# Altium schematic sheet 11.SchDoc
size 513 x 386 mm
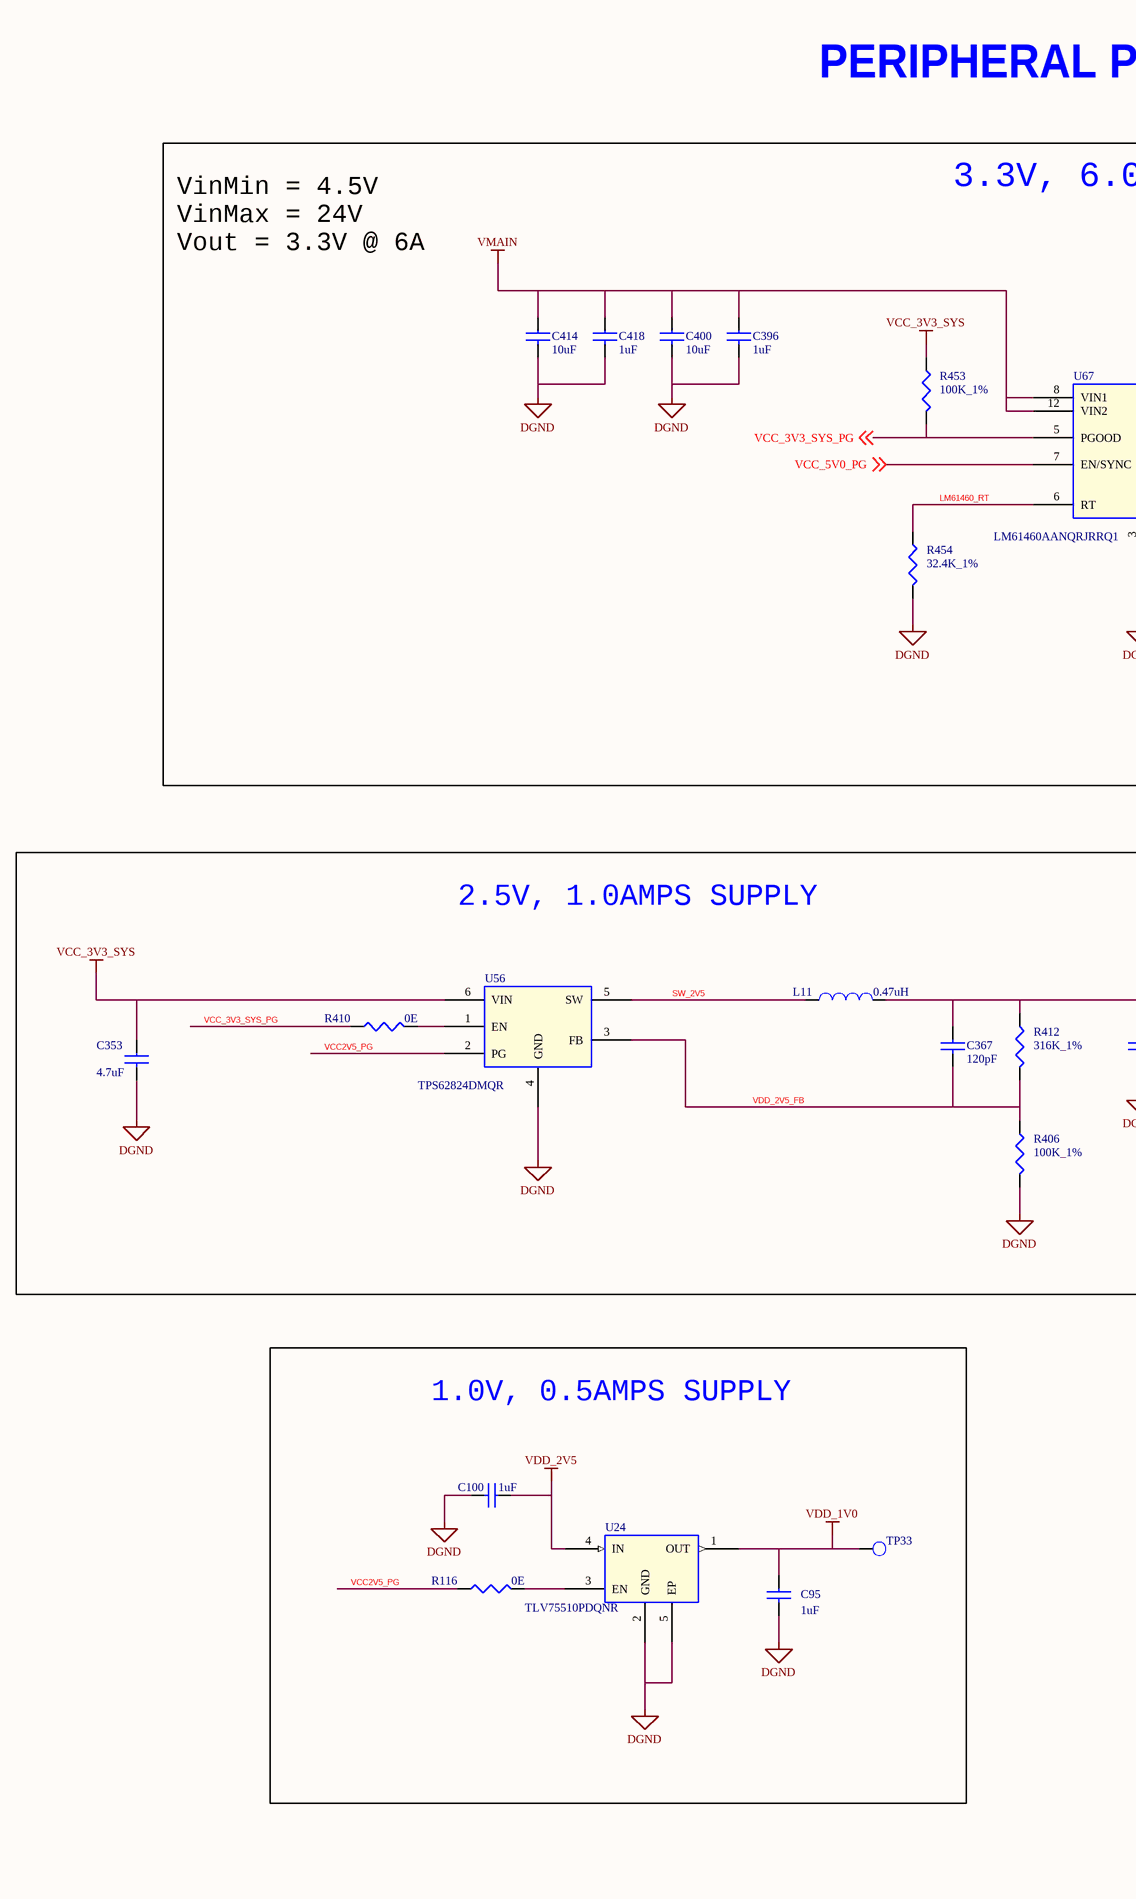
[diagram p0: 11.SchDoc, left]
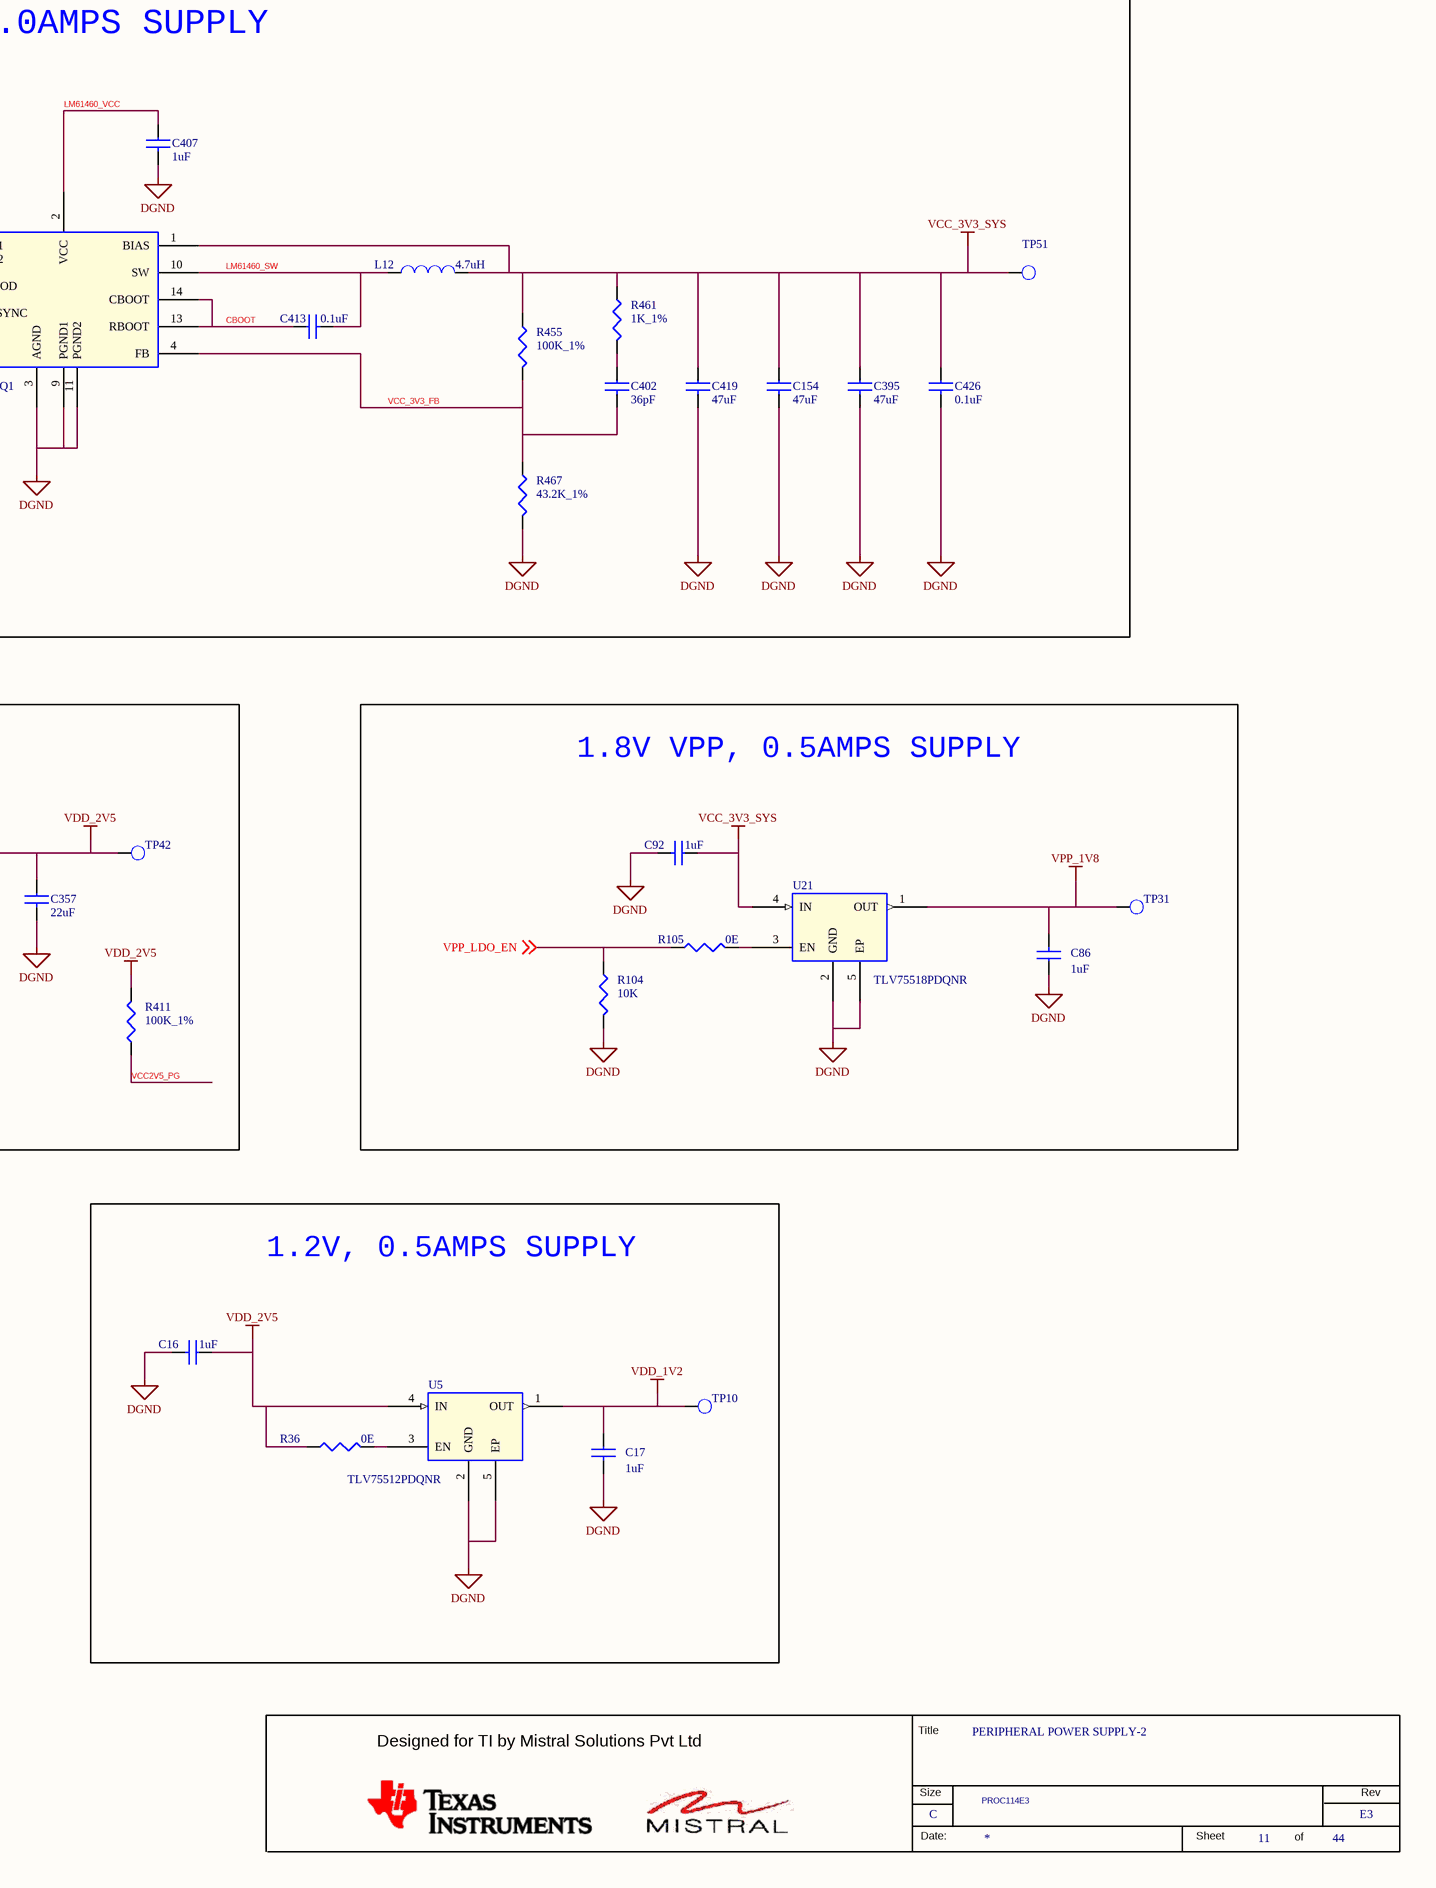
[diagram p1: 11.SchDoc, right]

## Parts
*  RevCode: E3  Title: PERIPHERAL POWER SUPPLY-2  Page Size: C  Page Number: 11  Page Count: 44  Variant Name: PROC114E3  (hidden comment: MISTRAL_TITLEBLK_CSIZE)  (graphical)
C16  1uF  [CAP0201_0-5]
C17  1uF  [CAP0201_0-5]
C86  1uF  [CAP0201_0-5]
C92  1uF  [CAP0201_0-5]
C95  1uF  [CAP0201_0-5]
C100  1uF  [CAP0201_0-5]
C154  47uF  [CAP1210_2-75]
C353  4.7uF  [CAP0603_1]
C357  22uF  [CAP0603_1]
C367  120pF  [CAP0201_0-5]
C395  47uF  [CAP1210_2-75]
C396  1uF  [CAP0805_1-5]
C400  10uF  [CAP0603_1]
C402  36pF  [CAP0402_0-75]
C407  1uF  [CAP0201_0-5]
C413  0.1uF  [CAP0402_0-75]
C414  10uF  [CAP0603_1]
C418  1uF  [CAP0805_1-5]
C419  47uF  [CAP1210_2-75]
C426  0.1uF  [CAP0402_0-75]
L11  0.47uH  [IND0806_1-2]
L12  4.7uH  [IND_XAL6060_260X270_SMD_6-1]
R36  0E  [RES0201_0-5]
R104  10K  [RES0201_0-5]
R105  0E  [RES0201_0-5]
R116  0E  [RES0201_0-5]
R406  100K_1%  [RES0402_0-5]
R410  0E  [RES0201_0-5]
R411  100K_1%  [RES0402_0-5]
R412  316K_1%  [RES0402_0-5]
R453  100K_1%  [RES0402_0-5]
R454  32.4K_1%  [RES0402_0-5]
R455  100K_1%  [RES0402_0-5]
R461  1K_1%  [RES0402_0-5]
R467  43.2K_1%  [RES0402_0-5]
TP10  TP20_SMD  [TP20_SMD]  (value not drawn)
TP31  TP20_SMD  [TP20_SMD]  (value not drawn)
TP33  TP20_SMD  [TP20_SMD]  (value not drawn)
TP42  TP20_SMD  [TP20_SMD]  (value not drawn)
TP51  TP20_SMD  [TP20_SMD]  (value not drawn)
U5  TLV75512PDQNR  [X2SON4_TLV71318P_40X40_0-4]
U21  TLV75518PDQNR  [X2SON4_TLV71318P_40X40_0-4]
U24  TLV75510PDQNR  [X2SON4_TLV71318P_40X40_0-4]
U56  TPS62824DMQR  [VSONHR6_TPS62826_60X60_1]
U67  LM61460AANQRJRRQ1  [VQFNHR14_LM61460_160X140_1]

## Blocks framed on the sheet
3.3V, 6.0AMPS SUPPLY: C154 C395 C396 C400 C402 C407 C413 C414 C418 C419 C426 L12 R453-R455 R461 R467 TP51 U67
2.5V, 1.0AMPS SUPPLY: C353 C357 C367 L11 R406 R410-R412 TP42 U56
1.8V VPP, 0.5AMPS SUPPLY: C86 C92 R104 R105 TP31 U21
1.0V, 0.5AMPS SUPPLY: C95 C100 R116 TP33 U24
1.2V, 0.5AMPS SUPPLY: C16 C17 R36 TP10 U5

## Nets
DGND: C16.2 C17.2 C86.1 C92.2 C95.2 C100.2 C154.2 C353.2 C357.2 C395.2 C396.2 C400.2 C407.2 C414.2 C418.2 C419.2 C426.2 R104.2 R406.2 R454.2 R467.2 U5.2(GND) U5.5(EP) U21.2(GND) U21.5(EP) U24.2(GND) U24.5(EP) U56.4(GND) U67.3(AGND) U67.9(PGND1) U67.11(PGND2)
VCC_3V3_SYS: C92.1 C154.1 C353.1 C395.1 C419.1 C426.1 L12.2 R453.1 R455.1 R461.1 TP51.1(TP) U21.4(IN) U56.6(VIN) U67.1(BIAS)
VDD_1V0: C95.1 TP33.1(TP) U24.1(OUT)
VDD_1V2: C17.1 TP10.1(TP) U5.1(OUT)
VDD_2V5: C16.1 C100.1 C357.1 C367.1 L11.2 R36.1 R411.2 R412.1 TP42.1(TP) U5.4(IN) U24.4(IN)
VMAIN: C396.1 C400.1 C414.1 C418.1 U67.8(VIN1) U67.12(VIN2)
VPP_1V8: C86.2 TP31.1(TP) U21.1(OUT)
CBOOT: C413.1 U67.13(RBOOT) U67.14(CBOOT)
LM61460_RT: R454.1 U67.6(RT)
LM61460_SW: C413.2 L12.1 U67.10(SW)
LM61460_VCC: C407.1 U67.2(VCC)
SW_2V5: L11.1 U56.5(SW)
VCC2V5_PG: R116.1 R411.1 U56.2(PG)
VCC_3V3_FB: C402.2 R455.2 R467.1 U67.4(FB)
VCC_3V3_SYS_PG: R410.1 R453.2 U67.5(PGOOD) ; off-sheet VCC_3V3_SYS_PG
VCC_5V0_PG: U67.7(EN/SYNC) ; off-sheet VCC_5V0_PG
VDD_2V5_FB: C367.2 R406.1 R412.2 U56.3(FB)
VPP_LDO_EN: R104.1 R105.1 ; off-sheet VPP_LDO_EN
NetC402_1: C402.1 R461.2
NetR36_2: R36.2 U5.3(EN)
NetR105_2: R105.2 U21.3(EN)
NetR116_2: R116.2 U24.3(EN)
NetR410_2: R410.2 U56.1(EN)

## Notes on the sheet
- PERIPHERAL POWER SUPPLY-2
- VinMin = 4.5V
  VinMax = 24V
  Vout = 3.3V @ 6A
- (in symbol MISTRAL_TITLEBLK_CSIZE) Title; Designed for TI by Mistral Solutions Pvt Ltd; Size; Rev; Date:; Sheet; of

## Library data of the parts
* = MISTRAL_TITLEBLK_CSIZE: Issue: 1.0; Page Create Date: March  8, 1995; Page Modify Date: *; Schematic Page Count: 44; Schematic Page Number: 11
C16 C407 = CAP_Dup2: CAP CERAMIC 1uF 16V 20% X5R 0201; Mistral Part No: 120018090038-R; Mfr_name: MURATA; Mfr_part_number: GRM033R61C105ME15D; Part_type: CAPACITORS\CERAMIC; Project: QCS610_NANOSOM; Wattage: NA; Customs_HS_Code: 85322990; Custom_Duty: 15%; Library Ref: CAP; MECHANICAL 3D STEP FILE: CAP0201_0-5; Tolerance: 20%; Voltage: 16V; Package: 0201; Distributor_name: DIGIKEY; Distributor_part_number: 490-18654-1-ND; Height: 0.39MM; Weight: 0.33mg; Temperature: -55°C+85°C; Datasheet: Y:\MIS_DATABASE\DATASHEETS\CAPACITORS\GRM033R61C105ME15.PDF; Crtd /date: ALVY/260520; Chkd/date: MANIRAJA/300520; Footprint Ref: CAP0201_0-5; Library Path: Y:\MIS_DATABASE\Library\ALTIUM_TOOL\SCHEMATICS_PARTS\MS_DISCRETE_Library.schlib; Footprint Path: Y:\MIS_DATABASE\Library\ALTIUM_TOOL\PCB_FOOTPRINTS\Altium_Footprint_Lib.PcbLib; PCB Footprint: CAP0201_0-5
C17 C86 C92 C95 C100 = CAP_Dup2: CAP CERAMIC 1uF 16V 20% X5R 0201; Part_type: CAPACITORS\CERAMIC; Mfr_part_number: GRM033R61C105ME15D; Mfr_name: MURATA; Mistral Part No: 120018090038-R; Custom_Duty: 15%; Customs_HS_Code: 85322990; Wattage: NA; Project: QCS610_NANOSOM; Footprint Path: Y:\MIS_DATABASE\Library\ALTIUM_TOOL\PCB_FOOTPRINTS\Altium_Footprint_Lib.PcbLib; Library Path: Y:\MIS_DATABASE\Library\ALTIUM_TOOL\SCHEMATICS_PARTS\MS_DISCRETE_Library.schlib; Footprint Ref: CAP0201_0-5; Chkd/date: MANIRAJA/300520; Crtd /date: ALVY/260520; Datasheet: Y:\MIS_DATABASE\DATASHEETS\CAPACITORS\GRM033R61C105ME15.PDF; Temperature: -55°C+85°C; Weight: 0.33mg; Height: 0.39MM; Distributor_part_number: 490-18654-1-ND; Distributor_name: DIGIKEY; Package: 0201; Voltage: 16V; Tolerance: 20%; MECHANICAL 3D STEP FILE: CAP0201_0-5; Library Ref: CAP; PCB Footprint: CAP0201_0-5
C154 C419 = CAP_Dup2: CAP CERAMIC 47uF 16V 10% X6S 1210; Mistral Part No: 120021070001-R; Mfr_name: MURATA; Mfr_part_number: GRM32EC81C476KE15L; Part_type: CAPACITORS\CERAMIC; Project: TI_AM263X_CC; Wattage: NA; Customs_HS_Code: 85322990; Custom_Duty: 15%; Footprint Ref: CAP1210_2-75; Tolerance: 10%; Voltage: 16V; Package: 1210; Distributor_name: DIGIKEY; Distributor_part_number: 490-10531-1-ND; Library Ref: CAP; Height: 2.70MM; Weight: 100mg; Temperature: -55°C+105°C; Datasheet: Y:\MIS_DATABASE\DATASHEETS\CAPACITORS\GRM32EC81C476KE15.PDF; Crtd /date: MANIRAJA/010721; Chkd/date: ALVY/010721; MECHANICAL 3D STEP FILE: CAP1210_2-75; Library Path: Y:\MIS_DATABASE\Library\ALTIUM_TOOL\SCHEMATICS_PARTS\MS_DISCRETE_Library.schlib; Footprint Path: Y:\MIS_DATABASE\Library\ALTIUM_TOOL\PCB_FOOTPRINTS\Altium_Footprint_Lib.PcbLib; PCB Footprint: CAP1210_2-75
C353 = CAP_Dup2: CAP CERAMIC 4.7uF 35V 20% X5R 0603; Mistral Part No: 120020050017-R; Mfr_name: MURATA; Mfr_part_number: GRM188R6YA475ME15D; Part_type: CAPACITORS\CERAMIC; Project: SD865_NANOSOM; Wattage: NA; Customs_HS_Code: 85322990; Custom_Duty: 15%; PCB Footprint: CAP0603_1; Footprint Path: Y:\MIS_DATABASE\Library\ALTIUM_TOOL\PCB_FOOTPRINTS\Altium_Footprint_Lib.PcbLib; Library Path: Y:\MIS_DATABASE\Library\ALTIUM_TOOL\SCHEMATICS_PARTS\MS_DISCRETE_Library.schlib; Footprint Ref: CAP0603_1; Library Ref: CAP; Tolerance: 20%; Voltage: 35V; Package: 0603; Distributor_name: DIGIKEY; Distributor_part_number: 490-11995-1-ND; Height: 1.00MM; Weight: 6.3mg; Temperature: -55°C+85°C; Datasheet: Y:\MIS_DATABASE\DATASHEETS\CAPACITORS\GRM188R6YA475ME15.PDF; Crtd /date: ALVY/120520; Chkd/date: MANIRAJA/120520; MECHANICAL 3D STEP FILE: CAP0603_1
C357 = CAP_Dup2: CAP CERAMIC 22uF 10V 20% X5R 0603; Mistral Part No: 120014100009-R; Mfr_name: MURATA; Mfr_part_number: GRM188R61A226ME15D; Part_type: CAPACITORS\CERAMIC; Project: TI_MAXIE_CPB; Wattage: NA; Customs_HS_Code: 85322990; Custom_Duty: 15%; PCB Footprint: CAP0603_1; Footprint Path: Y:\MIS_DATABASE\Library\ALTIUM_TOOL\PCB_FOOTPRINTS\Altium_Footprint_Lib.PcbLib; Library Path: Y:\MIS_DATABASE\Library\ALTIUM_TOOL\SCHEMATICS_PARTS\MS_DISCRETE_Library.schlib; MECHANICAL 3D STEP FILE: CAP0603_1; Footprint Ref: CAP0603_1; Library Ref: CAP; Tolerance: 20%; Voltage: 10V; Package: 0603; Distributor_name: DIGIKEY; Distributor_part_number: 490-10476-1-ND; Height: 1.00MM; Weight: 6.3mg; Temperature: -55°C+85°C; Datasheet: Y:\MIS_DATABASE\DATASHEETS\CAPACITORS\GRM188R61A226ME15.PDF; Crtd /date: MANIRAJA/230118; Chkd/date: MANIRAJA/230118
C367 = CAP_Dup2: CAP CERAMIC 120pF 25V 10% X7R 0201; Part_type: CAPACITORS\CERAMIC; Mfr_part_number: GRM033R71E121KA01D; Mfr_name: MURATA; Mistral Part No: 120021080009-R; Custom_Duty: 15%; Customs_HS_Code: 85322990; Wattage: NA; Project: TI_AM62x SKEVM_BRD; PCB Footprint: CAP0201_0-5; Footprint Path: Y:\MIS_DATABASE\Library\ALTIUM_TOOL\PCB_FOOTPRINTS\Altium_Footprint_Lib.PcbLib; Library Path: Y:\MIS_DATABASE\Library\ALTIUM_TOOL\SCHEMATICS_PARTS\MS_DISCRETE_Library.schlib; MECHANICAL 3D STEP FILE: CAP0201_0-5; Chkd/date: ALVY/260821; Crtd /date: MANIRAJA/260821; Datasheet: Y:\MIS_DATABASE\DATASHEETS\CAPACITORS\GRM033R71E121KA01.PDF; Temperature: -55°C+125°C; Weight: 0.33mg; Height: 0.33MM; Library Ref: CAP; Distributor_part_number: 490-3173-1-ND; Distributor_name: DIGIKEY; Package: 0201; Voltage: 25V; Tolerance: 10%; Footprint Ref: CAP0201_0-5
C395 = CAP_Dup2: CAP CERAMIC 47uF 16V 10% X6S 1210; Part_type: CAPACITORS\CERAMIC; Mfr_part_number: GRM32EC81C476KE15L; Mfr_name: MURATA; Mistral Part No: 120021070001-R; Custom_Duty: 15%; Customs_HS_Code: 85322990; Wattage: NA; Project: TI_AM263X_CC; Footprint Path: Y:\MIS_DATABASE\Library\ALTIUM_TOOL\PCB_FOOTPRINTS\Altium_Footprint_Lib.PcbLib; Library Path: Y:\MIS_DATABASE\Library\ALTIUM_TOOL\SCHEMATICS_PARTS\MS_DISCRETE_Library.schlib; MECHANICAL 3D STEP FILE: CAP1210_2-75; Chkd/date: ALVY/010721; Crtd /date: MANIRAJA/010721; Datasheet: Y:\MIS_DATABASE\DATASHEETS\CAPACITORS\GRM32EC81C476KE15.PDF; Temperature: -55°C+105°C; Weight: 100mg; Height: 2.70MM; Library Ref: CAP; Distributor_part_number: 490-10531-1-ND; Distributor_name: DIGIKEY; Package: 1210; Voltage: 16V; Tolerance: 10%; Footprint Ref: CAP1210_2-75; PCB Footprint: CAP1210_2-75
C396 C418 = CAP_Dup2: CAP CERAMIC 1uF 100V 10% X7S 0805; Mistral Part No: 120013030002-R; Mfr_name: MURATA; Mfr_part_number: GRM21BC72A105KE01L; Part_type: CAPACITORS\CERAMIC; Project: TI_AM62x SKEVM_BRD; Wattage: NA; Customs_HS_Code: 85322990; Custom_Duty: 15%; Footprint Ref: CAP0805_1-5; Tolerance: 10%; Voltage: 100V; Package: 0805; Distributor_name: DIGIKEY; Distributor_part_number: 490-14464-1-ND; Library Ref: CAP; Height: 1.45MM; Weight: 6.4mg; Temperature: -55°C+125°C; Datasheet: Y:\MIS_DATABASE\DATASHEETS\CAPACITORS\GRM21BC72A105KE01.PDF; Crtd /date: ALVY/150921; Chkd/date: MANIRAJA/160921; MECHANICAL 3D STEP FILE: CAP0805_1-5; Library Path: Y:\MIS_DATABASE\Library\ALTIUM_TOOL\SCHEMATICS_PARTS\MS_DISCRETE_Library.schlib; Footprint Path: Y:\MIS_DATABASE\Library\ALTIUM_TOOL\PCB_FOOTPRINTS\Altium_Footprint_Lib.PcbLib; PCB Footprint: CAP0805_1-5
C400 = CAP_Dup2: CAP CERAMIC 10uF 35V 20% X5R 0603; Mistral Part No: 120019050016-R; Mfr_name: MURATA; Mfr_part_number: GRM188R6YA106MA73D; Part_type: CAPACITORS\CERAMIC; Project: BRUKER_SD820_COMMONDO; Wattage: NA; Customs_HS_Code: 85322990; Custom_Duty: 15%; Footprint Ref: CAP0603_1; Tolerance: 20%; Voltage: 35V; Package: 0603; Distributor_name: DIGIKEY; Distributor_part_number: 490-13248-1-ND; Library Ref: CAP; Height: 1.00MM; Weight: 9mg; Temperature: -55°C+85°C; Datasheet: Y:\MIS_DATABASE\DATASHEETS\CAPACITORS\GRM188R6YA106MA73.PDF; Crtd /date: ALVY/160519; Chkd/date: MANIRAJA/170519; MECHANICAL 3D STEP FILE: CAP0603_1; Library Path: Y:\MIS_DATABASE\Library\ALTIUM_TOOL\SCHEMATICS_PARTS\MS_DISCRETE_Library.schlib; Footprint Path: Y:\MIS_DATABASE\Library\ALTIUM_TOOL\PCB_FOOTPRINTS\Altium_Footprint_Lib.PcbLib; PCB Footprint: CAP0603_1
C402 = CAP_Dup2: CAP CERAMIC 36pF 50V 2% HI-Q C0G(NP0) 0402; Mistral Part No: 120021100002-R; Mfr_name: MURATA; Mfr_part_number: GJM1555C1H360GB01D; Part_type: CAPACITORS\CERAMIC; Project: TI_AM62x SKEVM_BRD; Wattage: NA; Customs_HS_Code: 85322990; Custom_Duty: 15%; Footprint Ref: CAP0402_0-75; Tolerance: 2%; Voltage: 50V; Package: 0402; Distributor_name: DIGIKEY; Distributor_part_number: 490-GJM1555C1H360GB01DTR-ND; Library Ref: CAP; Height: 0.55MM; Weight: 1.5mg; Temperature: -55°C+125°C; Datasheet: Y:\MIS_DATABASE\DATASHEETS\CAPACITORS\GJM1555C1H360GB01.PDF; Crtd /date: ALVY/051021; Chkd/date: MANIRAJA/061021; MECHANICAL 3D STEP FILE: CAP0402_0-75; Library Path: Y:\MIS_DATABASE\Library\ALTIUM_TOOL\SCHEMATICS_PARTS\MS_DISCRETE_Library.schlib; Footprint Path: Y:\MIS_DATABASE\Library\ALTIUM_TOOL\PCB_FOOTPRINTS\Altium_Footprint_Lib.PcbLib; PCB Footprint: CAP0402_0-75
C413 = CAP_Dup2: CAP CERAMIC 0.1uF 50V 10% X7R 0402; Part_type: CAPACITORS\CERAMIC; Mfr_part_number: GRM155R71H104KE14D; Mfr_name: MURATA; Mistral Part No: 120011100014-R; Custom_Duty: 15%; Customs_HS_Code: 85322990; Wattage: NA; Project: J7_CP; Footprint Path: Y:\MIS_DATABASE\Library\ALTIUM_TOOL\PCB_FOOTPRINTS\Altium_Footprint_Lib.PcbLib; Library Path: Y:\MIS_DATABASE\Library\ALTIUM_TOOL\SCHEMATICS_PARTS\MS_DISCRETE_Library.schlib; MECHANICAL 3D STEP FILE: CAP0402_0-75; Chkd/date: MANIRAJA/261020; Crtd /date: ALVY/211020; Datasheet: Y:\MIS_DATABASE\DATASHEETS\CAPACITORS\GRM155R71H104KE14.PDF; Temperature: -55°C+125°C; Weight: 3.1mg; Height: 0.55MM; Library Ref: CAP; Distributor_part_number: 490-10700-1-ND; Distributor_name: DIGIKEY; Package: 0402; Voltage: 50V; Tolerance: 10%; Footprint Ref: CAP0402_0-75; PCB Footprint: CAP0402_0-75
C414 = CAP_Dup2: CAP CERAMIC 10uF 35V 20% X5R 0603; Part_type: CAPACITORS\CERAMIC; Mfr_part_number: GRM188R6YA106MA73D; Mfr_name: MURATA; Mistral Part No: 120019050016-R; Custom_Duty: 15%; Customs_HS_Code: 85322990; Wattage: NA; Project: BRUKER_SD820_COMMONDO; Footprint Path: Y:\MIS_DATABASE\Library\ALTIUM_TOOL\PCB_FOOTPRINTS\Altium_Footprint_Lib.PcbLib; Library Path: Y:\MIS_DATABASE\Library\ALTIUM_TOOL\SCHEMATICS_PARTS\MS_DISCRETE_Library.schlib; MECHANICAL 3D STEP FILE: CAP0603_1; Chkd/date: MANIRAJA/170519; Crtd /date: ALVY/160519; Datasheet: Y:\MIS_DATABASE\DATASHEETS\CAPACITORS\GRM188R6YA106MA73.PDF; Temperature: -55°C+85°C; Weight: 9mg; Height: 1.00MM; Library Ref: CAP; Distributor_part_number: 490-13248-1-ND; Distributor_name: DIGIKEY; Package: 0603; Voltage: 35V; Tolerance: 20%; Footprint Ref: CAP0603_1; PCB Footprint: CAP0603_1
C426 = CAP_Dup2: CAP CERAMIC 0.1uF 50V 10% X7R 0402; Mistral Part No: 120011100014-R; Mfr_name: MURATA; Mfr_part_number: GRM155R71H104KE14D; Part_type: CAPACITORS\CERAMIC; Project: J7_CP; Wattage: NA; Customs_HS_Code: 85322990; Custom_Duty: 15%; Footprint Ref: CAP0402_0-75; Tolerance: 10%; Voltage: 50V; Package: 0402; Distributor_name: DIGIKEY; Distributor_part_number: 490-10700-1-ND; Library Ref: CAP; Height: 0.55MM; Weight: 3.1mg; Temperature: -55°C+125°C; Datasheet: Y:\MIS_DATABASE\DATASHEETS\CAPACITORS\GRM155R71H104KE14.PDF; Crtd /date: ALVY/211020; Chkd/date: MANIRAJA/261020; MECHANICAL 3D STEP FILE: CAP0402_0-75; Library Path: Y:\MIS_DATABASE\Library\ALTIUM_TOOL\SCHEMATICS_PARTS\MS_DISCRETE_Library.schlib; Footprint Path: Y:\MIS_DATABASE\Library\ALTIUM_TOOL\PCB_FOOTPRINTS\Altium_Footprint_Lib.PcbLib; PCB Footprint: CAP0402_0-75
L11 = INDUCTOR: IND CHIP 0.47uH 4.5A 20% 0806; Mfr_part_number: DFE201612E-R47M=P2; Mfr_name: MURATA; Mistral Part No: 130020100030-R; Custom_Duty: 24%; Customs_HS_Code: 85437099; Wattage: NA; Project: AM64X_SKEVM; PCB Footprint: IND0806_1-2; Footprint Path: Y:\MIS_DATABASE\Library\ALTIUM_TOOL\PCB_FOOTPRINTS\Altium_Footprint_Lib.PcbLib; Library Path: Y:\MIS_DATABASE\Library\ALTIUM_TOOL\SCHEMATICS_PARTS\MS_DISCRETE_Library.schlib; MECHANICAL 3D STEP FILE: IND0806_1-2; Chkd/date: MANIRAJA/121020; Crtd /date: ALVY/121020; Datasheet: Y:\MIS_DATABASE\DATASHEETS\DISCRETES\INDUCTORS\DFE201612E.PDF; Temperature: -40°C+125°C; Weight: 18.8mg; Height: 1.20MM; Library Ref: INDUCTOR; Distributor_part_number: DFE201612E-R47M=P2-ND; Distributor_name: DIGIKEY; Package: 0806; Voltage: NA; Tolerance: 20%; Part_type: INDUCTOR; Footprint Ref: IND0806_1-2
L12 = INDUCTOR_Dup1: IND POWER 4.7uH 11A 20% SMD; Mistral Part No: 130015090013-R; Mfr_name: COILCRAFT; Mfr_part_number: XAL6060-472MEB; Project: OCTBTS_3000; Voltage: NA; Customs_HS_Code: 85412900; Custom_Duty: 15%; Footprint Ref: IND_XAL6060_260X270_SMD_6-1; Part_type: INDUCTOR; Tolerance: 20%; Wattage: NA; Package: SMD; Distributor_name: MOUSER; Distributor_part_number: 994-XAL6060-472MEB; Library Ref: INDUCTOR; Height: 6.10MM; Weight: 1600g; Temperature: -40°C+125°C; Datasheet: Y:\MIS_DATABASE\DATASHEETS\DISCRETES\INDUCTORS\XAL6060-SER.PDF; Crtd /date: MANIRAJA/090317; Chkd/date: VASANTHA/090317; MECHANICAL 3D STEP FILE: IND_XAL6060_260X270_SMD_6-1; Library Path: Y:\MIS_DATABASE\Library\ALTIUM_TOOL\SCHEMATICS_PARTS\MS_DISCRETE_Library.schlib; Footprint Path: Y:\MIS_DATABASE\Library\ALTIUM_TOOL\PCB_FOOTPRINTS\Altium_Footprint_Lib.PcbLib; PCB Footprint: IND_XAL6060_260X270_SMD_6-1
R36 = RESISTOR_Dup6: RES 0E 1/20W 5% 0201; Mistral Part No: 110010070067-R; Mfr_name: YAGEO AMERICA; Mfr_part_number: RC0201JR-070RL; Part_type: RESISTORS\FIXED; Project: PB_BUGBASE; Voltage: NA; Customs_HS_Code: 85332119; Custom_Duty: 15%; Footprint Ref: RES0201_0-5; Tolerance: 5%; Wattage: 1/20W; Package: 0201; Distributor_name: DIGIKEY; Distributor_part_number: 311-0.0NCT-ND; Library Ref: RESISTOR; Height: 0.26MM; Weight: 0.17mg; Temperature: -55°C+125°C; Datasheet: Y:\MIS_DATABASE\DATASHEETS\RESISTORS\RCXXXXL-SER_MAR18.PDF; Crtd /date: MUDDU/120710; Chkd/date: NAVEED/301214; MECHANICAL 3D STEP FILE: RES0201_0-5; Library Path: Y:\MIS_DATABASE\Library\ALTIUM_TOOL\SCHEMATICS_PARTS\MS_DISCRETE_Library.schlib; Footprint Path: Y:\MIS_DATABASE\Library\ALTIUM_TOOL\PCB_FOOTPRINTS\Altium_Footprint_Lib.PcbLib; PCB Footprint: RES0201_0-5
R104 = RESISTOR_Dup6: RES 10K 1/20W 5% 0201; Part_type: RESISTORS\FIXED; Mfr_part_number: RC0201JR-0710KL; Mfr_name: YAGEO AMERICA; Mistral Part No: 110010070051-R; Custom_Duty: 15%; Customs_HS_Code: 85332119; Voltage: NA; Project: GOLDEN-I LITE; MECHANICAL 3D STEP FILE: RES0201_0-5; Chkd/date: MANIRAJA/050517; Crtd /date: MANIRAJA/050517; Datasheet: Y:\MIS_DATABASE\DATASHEETS\RESISTORS\RCXXXXL-SER_MAR18.PDF; Temperature: -55°C+125°C; Weight: 0.17mg; Height: 0.26MM; Distributor_part_number: 311-10KNCT-ND; Distributor_name: DIGIKEY; Package: 0201; Wattage: 1/20W; Tolerance: 5%; Library Ref: RESISTOR; Footprint Ref: RES0201_0-5; Library Path: Y:\MIS_DATABASE\Library\ALTIUM_TOOL\SCHEMATICS_PARTS\MS_DISCRETE_Library.schlib; Footprint Path: Y:\MIS_DATABASE\Library\ALTIUM_TOOL\PCB_FOOTPRINTS\Altium_Footprint_Lib.PcbLib; PCB Footprint: RES0201_0-5
R105 R116 R410 = RESISTOR_Dup6: RES 0E 1/20W 5% 0201; Part_type: RESISTORS\FIXED; Mfr_part_number: RC0201JR-070RL; Mfr_name: YAGEO AMERICA; Mistral Part No: 110010070067-R; Custom_Duty: 15%; Customs_HS_Code: 85332119; Voltage: NA; Project: PB_BUGBASE; Footprint Path: Y:\MIS_DATABASE\Library\ALTIUM_TOOL\PCB_FOOTPRINTS\Altium_Footprint_Lib.PcbLib; Library Path: Y:\MIS_DATABASE\Library\ALTIUM_TOOL\SCHEMATICS_PARTS\MS_DISCRETE_Library.schlib; MECHANICAL 3D STEP FILE: RES0201_0-5; Chkd/date: NAVEED/301214; Crtd /date: MUDDU/120710; Datasheet: Y:\MIS_DATABASE\DATASHEETS\RESISTORS\RCXXXXL-SER_MAR18.PDF; Temperature: -55°C+125°C; Weight: 0.17mg; Height: 0.26MM; Library Ref: RESISTOR; Distributor_part_number: 311-0.0NCT-ND; Distributor_name: DIGIKEY; Package: 0201; Wattage: 1/20W; Tolerance: 5%; Footprint Ref: RES0201_0-5; PCB Footprint: RES0201_0-5
R406 = RESISTOR: RES 100K 1/10W 1% 0402; Part_type: RESISTORS\FIXED; Mfr_part_number: ERJ-2RKF1003X; Mfr_name: PANASONIC-ECG; Mistral Part No: 110009030187-R; Custom_Duty: 15%; Customs_HS_Code: 85332119; Voltage: NA; Project: J32; PCB Footprint: RES0402_0-5; Footprint Path: Y:\MIS_DATABASE\Library\ALTIUM_TOOL\PCB_FOOTPRINTS\Altium_Footprint_Lib.PcbLib; Library Path: Y:\MIS_DATABASE\Library\ALTIUM_TOOL\SCHEMATICS_PARTS\MS_DISCRETE_Library.schlib; MECHANICAL 3D STEP FILE: RES0402_0-5; Footprint Ref: RES0402_0-5; Library Ref: RESISTOR; Chkd/date: VASANTHA/201216; Crtd /date: MAZHAR/130306; Datasheet: Y:\MIS_DATABASE\DATASHEETS\RESISTORS\PAN-ERJSER_NOV17.PDF; Temperature: -55°C+155°C; Weight: 0.8mg; Height: 0.40MM; Distributor_part_number: P100KLCT-ND; Distributor_name: DIGIKEY; Package: 0402; Wattage: 1/10W; Tolerance: 1%
R411 R453 = RESISTOR_Dup6: RES 100K 1/10W 1% 0402; Part_type: RESISTORS\FIXED; Mfr_part_number: ERJ-2RKF1003X; Mfr_name: PANASONIC-ECG; Mistral Part No: 110009030187-R; Custom_Duty: 15%; Customs_HS_Code: 85332119; Voltage: NA; Project: J32; PCB Footprint: RES0402_0-5; Footprint Path: Y:\MIS_DATABASE\Library\ALTIUM_TOOL\PCB_FOOTPRINTS\Altium_Footprint_Lib.PcbLib; Library Path: Y:\MIS_DATABASE\Library\ALTIUM_TOOL\SCHEMATICS_PARTS\MS_DISCRETE_Library.schlib; Footprint Ref: RES0402_0-5; Library Ref: RESISTOR; MECHANICAL 3D STEP FILE: RES0402_0-5; Chkd/date: VASANTHA/201216; Crtd /date: MAZHAR/130306; Datasheet: Y:\MIS_DATABASE\DATASHEETS\RESISTORS\PAN-ERJSER_NOV17.PDF; Temperature: -55°C+155°C; Weight: 0.8mg; Height: 0.40MM; Distributor_part_number: P100KLCT-ND; Distributor_name: DIGIKEY; Package: 0402; Wattage: 1/10W; Tolerance: 1%
R412 = RESISTOR_Dup6: RES 316K 1/10W 1% 0402; Part_type: RESISTORS\FIXED; Mfr_part_number: ERJ-2RKF3163X; Mfr_name: PANASONIC-ECG; Mistral Part No: 110010030027-R; Custom_Duty: 15%; Customs_HS_Code: 85332119; Voltage: NA; Project: VME_DSP_SUITE; PCB Footprint: RES0402_0-5; Chkd/date: MAZHAR/110310; Crtd /date: MUDDU/080310; Datasheet: Y:\MIS_DATABASE\DATASHEETS\RESISTORS\PAN-ERJSER_NOV17.PDF; Temperature: -55°C+155°C; Weight: 0.8mg; Height: 0.40MM; Distributor_part_number: P316KLCT-ND; Distributor_name: DIGIKEY; Package: 0402; Wattage: 1/10W; Tolerance: 1%; MECHANICAL 3D STEP FILE: RES0402_0-5; Library Ref: RESISTOR; Footprint Ref: RES0402_0-5; Library Path: Y:\MIS_DATABASE\Library\ALTIUM_TOOL\SCHEMATICS_PARTS\MS_DISCRETE_Library.schlib; Footprint Path: Y:\MIS_DATABASE\Library\ALTIUM_TOOL\PCB_FOOTPRINTS\Altium_Footprint_Lib.PcbLib
R454 = RESISTOR_Dup6: RES 32.4K 1/16W 1% 0402; Mistral Part No: 110020040003-R; Mfr_name: VISHAY; Mfr_part_number: CRCW040232K4FKED; Part_type: RESISTORS\FIXED; Project: HSDTRS_FEE_BRD; Voltage: NA; Customs_HS_Code: 85332119; Custom_Duty: 15%; Footprint Ref: RES0402_0-5; Tolerance: 1%; Wattage: 1/16W; Package: 0402; Distributor_name: DIGIKEY; Distributor_part_number: 541-32.4KLCT-ND; Library Ref: RESISTOR; Height: 0.40MM; Weight: 0.65mg; Temperature: -55°C+155°C; Datasheet: Y:\MIS_DATABASE\DATASHEETS\RESISTORS\CRCW0603.PDF; Crtd /date: ALVY/080420; Chkd/date: MANIRAJA/080420; MECHANICAL 3D STEP FILE: RES0402_0-5; Library Path: Y:\MIS_DATABASE\Library\ALTIUM_TOOL\SCHEMATICS_PARTS\MS_DISCRETE_Library.schlib; Footprint Path: Y:\MIS_DATABASE\Library\ALTIUM_TOOL\PCB_FOOTPRINTS\Altium_Footprint_Lib.PcbLib; PCB Footprint: RES0402_0-5
R455 = RESISTOR_Dup6: RES 100K 1/10W 1% 0402; Mistral Part No: 110009030187-R; Mfr_name: PANASONIC-ECG; Mfr_part_number: ERJ-2RKF1003X; Part_type: RESISTORS\FIXED; Project: J32; Voltage: NA; Customs_HS_Code: 85332119; Custom_Duty: 15%; Footprint Ref: RES0402_0-5; Tolerance: 1%; Wattage: 1/10W; Package: 0402; Distributor_name: DIGIKEY; Distributor_part_number: P100KLCT-ND; Library Ref: RESISTOR; Height: 0.40MM; Weight: 0.8mg; Temperature: -55°C+155°C; Datasheet: Y:\MIS_DATABASE\DATASHEETS\RESISTORS\PAN-ERJSER_NOV17.PDF; Crtd /date: MAZHAR/130306; Chkd/date: VASANTHA/201216; MECHANICAL 3D STEP FILE: RES0402_0-5; Library Path: Y:\MIS_DATABASE\Library\ALTIUM_TOOL\SCHEMATICS_PARTS\MS_DISCRETE_Library.schlib; Footprint Path: Y:\MIS_DATABASE\Library\ALTIUM_TOOL\PCB_FOOTPRINTS\Altium_Footprint_Lib.PcbLib; PCB Footprint: RES0402_0-5
R461 = RESISTOR_Dup6: RES 1K 1/10W 1% 0402; Part_type: RESISTORS\FIXED; Mfr_part_number: ERJ-2RKF1001X; Mfr_name: PANASONIC-ECG; Mistral Part No: 110009030411-R; Custom_Duty: 15%; Customs_HS_Code: 85332119; Voltage: NA; Project: VOCERA; Footprint Path: Y:\MIS_DATABASE\Library\ALTIUM_TOOL\PCB_FOOTPRINTS\Altium_Footprint_Lib.PcbLib; Library Path: Y:\MIS_DATABASE\Library\ALTIUM_TOOL\SCHEMATICS_PARTS\MS_DISCRETE_Library.schlib; MECHANICAL 3D STEP FILE: RES0402_0-5; Chkd/date: VASANTHA/281216; Crtd /date: MAZHAR/150506; Datasheet: Y:\MIS_DATABASE\DATASHEETS\RESISTORS\PAN-ERJSER_NOV17.PDF; Temperature: -55°C+155°C; Weight: 0.8mg; Height: 0.40MM; Library Ref: RESISTOR; Distributor_part_number: P1.00KLCT-ND; Distributor_name: DIGIKEY; Package: 0402; Wattage: 1/10W; Tolerance: 1%; Footprint Ref: RES0402_0-5; PCB Footprint: RES0402_0-5
R467 = RESISTOR_Dup6: RES 43.2K 1/16W 1% 0402; Mistral Part No: 110021080019-R; Mfr_name: VISHAY; Mfr_part_number: CRCW040243K2FKED; Part_type: RESISTORS\FIXED; Project: TI_AM62x SKEVM_BRD; Voltage: NA; Customs_HS_Code: 85332119; Custom_Duty: 15%; Footprint Ref: RES0402_0-5; Tolerance: 1%; Wattage: 1/16W; Package: 0402; Distributor_name: DIGIKEY; Distributor_part_number: 541-43.2KLCT-ND; Library Ref: RESISTOR; Height: 0.40MM; Weight: 0.65mg; Temperature: -55°C+155°C; Datasheet: Y:\MIS_DATABASE\DATASHEETS\RESISTORS\CRCW0603.PDF; Crtd /date: ALVY/250821; Chkd/date: MANIRAJA/250821; MECHANICAL 3D STEP FILE: RES0402_0-5; Library Path: Y:\MIS_DATABASE\Library\ALTIUM_TOOL\SCHEMATICS_PARTS\MS_DISCRETE_Library.schlib; Footprint Path: Y:\MIS_DATABASE\Library\ALTIUM_TOOL\PCB_FOOTPRINTS\Altium_Footprint_Lib.PcbLib; PCB Footprint: RES0402_0-5
TP10 TP31 TP51 = TESTPOINT: TESTPOINT CIR 20 SMD; Mfr_name: LOCAL; Custom_Duty: NA; Project: BT MODULE_CSRBC04; Customs_HS_Code: NA; RoHS: NA; Footprint Ref: TP20_SMD; Library Ref: TESTPOINT; Mistral Part No: NA; Mfr_part_number: TP20_SMD; Part_type: TESTPOINT; Package: SMD; Distributor_name: NA; Distributor_part_number: NA; Height: NA; Crtd /date: MAZHAR/171006; Chkd/date: SHREESHAIL/171006; Tolerance: NA; Voltage: NA; Wattage: NA; Weight: NA; Temperature: NA; Datasheet: NA; MECHANICAL 3D STEP FILE: NA; Library Path: Y:\MIS_DATABASE\Library\ALTIUM_TOOL\SCHEMATICS_PARTS\MS_DISCRETE_Library.schlib; Footprint Path: Y:\MIS_DATABASE\Library\ALTIUM_TOOL\PCB_FOOTPRINTS\Altium_Footprint_Lib.PcbLib; PCB Footprint: TP20_SMD
TP33 TP42 = TESTPOINT: TESTPOINT CIR 20 SMD; Mfr_name: LOCAL; MECHANICAL 3D STEP FILE: NA; Project: BT MODULE_CSRBC04; Footprint Path: Y:\MIS_DATABASE\Library\ALTIUM_TOOL\PCB_FOOTPRINTS\Altium_Footprint_Lib.PcbLib; Library Path: Y:\MIS_DATABASE\Library\ALTIUM_TOOL\SCHEMATICS_PARTS\MS_DISCRETE_Library.schlib; Datasheet: NA; Temperature: NA; Weight: NA; Wattage: NA; Voltage: NA; Tolerance: NA; Chkd/date: SHREESHAIL/171006; Crtd /date: MAZHAR/171006; Height: NA; Distributor_part_number: NA; Distributor_name: NA; Package: SMD; Part_type: TESTPOINT; Mfr_part_number: TP20_SMD; Mistral Part No: NA; Library Ref: TESTPOINT; Footprint Ref: TP20_SMD; RoHS: NA; Customs_HS_Code: NA; Custom_Duty: NA; PCB Footprint: TP20_SMD
U5 = TLV71318PDQNR_X2SON4: IC 500mA 1.2V LOW IQ LDO REGULATOR X2SON-4; Part_type: ICS\POWER\VOLTAGE REGULATOR; Mfr_name: TEXAS INSTRUMENTS; Mistral Part No: 142021090022-R; Custom_Duty: 15%; Customs_HS_Code: 85423100; Wattage: NA; Project: TI_AM62x SKEVM_BRD; Footprint Path: Y:\MIS_DATABASE\Library\ALTIUM_TOOL\PCB_FOOTPRINTS\Altium_Footprint_Lib.PcbLib; Library Path: Y:\MIS_DATABASE\Library\ALTIUM_TOOL\SCHEMATICS_PARTS\MS_MISCPOWER_Library.schlib; MECHANICAL 3D STEP FILE: X2SON4_TLV71318P_40X40_0-4; Chkd/date: MANIRAJA/290921; Crtd /date: ALVY/290921; Datasheet: Y:\MIS_DATABASE\DATASHEETS\ICS\POWER\TLV755P.PDF; Temperature: -40°C+125°C; Weight: 1.1mg; Height: 0.40MM; Library Ref: TLV71318PDQNR_X2SON4; Distributor_part_number: 296-51785-1-ND; Distributor_name: DIGIKEY; Package: X2SON-4; Voltage: NA; Tolerance: NA; Mfr_part_number: TLV75512PDQNR; Footprint Ref: X2SON4_TLV71318P_40X40_0-4; PCB Footprint: X2SON4_TLV71318P_40X40_0-4
U21 = TLV71318PDQNR_X2SON4_Dup1: IC 500mA LOW IQ LDO REGULATOR X2SON-4; Part_type: ICS\POWER\VOLTAGE REGULATOR; Mfr_name: TEXAS INSTRUMENTS; Mistral Part No: 142020060013-R; Custom_Duty: 15%; Customs_HS_Code: 85423100; Wattage: NA; Project: AM64x-GP_EVM BRD; Footprint Path: Y:\MIS_DATABASE\Library\ALTIUM_TOOL\PCB_FOOTPRINTS\Altium_Footprint_Lib.PcbLib; Library Path: Y:\MIS_DATABASE\Library\ALTIUM_TOOL\SCHEMATICS_PARTS\MS_MISCPOWER_Library.schlib; MECHANICAL 3D STEP FILE: X2SON4_TLV71318P_40X40_0-4; Crtd /date: ALVY/160620; Datasheet: Y:\MIS_DATABASE\DATASHEETS\ICS\POWER\TLV755P.PDF; Temperature: -40°C+125°C; Weight: 1.1mg; Height: 0.40MM; Library Ref: TLV71318PDQNR_X2SON4; Distributor_part_number: 296-51790-1-ND; Distributor_name: DIGIKEY; Package: X2SON-4; Voltage: NA; Tolerance: NA; Mfr_part_number: TLV75518PDQNR; Footprint Ref: X2SON4_TLV71318P_40X40_0-4; PCB Footprint: X2SON4_TLV71318P_40X40_0-4
U24 = TLV71318PDQNR_X2SON4: IC 500mA 1V LOW IQ LDO REGULATOR X2SON-4; Mistral Part No: 142021080018-R; Mfr_name: TEXAS INSTRUMENTS; Part_type: ICS\POWER\VOLTAGE REGULATOR; Project: TI_AM62x SKEVM_BRD; Tolerance: NA; Customs_HS_Code: 85423100; Custom_Duty: 15%; Footprint Ref: X2SON4_TLV71318P_40X40_0-4; Mfr_part_number: TLV75510PDQNR; Voltage: NA; Wattage: NA; Package: X2SON-4; Distributor_name: DIGIKEY; Distributor_part_number: 296-51782-1-ND; Library Ref: TLV71318PDQNR_X2SON4; Height: 0.40MM; Weight: 1.1mg; Temperature: -40°C+125°C; Datasheet: Y:\MIS_DATABASE\DATASHEETS\ICS\POWER\TLV755P.PDF; Crtd /date: ALVY/240821; Chkd/date: MANIRAJA/240821; MECHANICAL 3D STEP FILE: X2SON4_TLV71318P_40X40_0-4; Library Path: Y:\MIS_DATABASE\Library\ALTIUM_TOOL\SCHEMATICS_PARTS\MS_MISCPOWER_Library.schlib; Footprint Path: Y:\MIS_DATABASE\Library\ALTIUM_TOOL\PCB_FOOTPRINTS\Altium_Footprint_Lib.PcbLib; PCB Footprint: X2SON4_TLV71318P_40X40_0-4
U56 = TPS62827DMQR_VSONHR6: IC 1A ADJ STEP-DOWN CONVERTER WITH 1% OUTPUT ACCURACY VSON-HR6; Mistral Part No: 142021100006-R; Mfr_name: TEXAS INSTRUMENTS; Part_type: ICS\POWER\DC-DC CONVERTER; Project: TI_AM62x SKEVM_BRD; Tolerance: NA; Customs_HS_Code: 85423100; Custom_Duty: 15%; PCB Footprint: VSONHR6_TPS62826_60X60_1; Footprint Ref: VSONHR6_TPS62826_60X60_1; Mfr_part_number: TPS62824DMQR; Voltage: NA; Wattage: NA; Package: VSON-HR6; Distributor_name: NA; Distributor_part_number: NA; Library Ref: TPS62827DMQR_VSONHR6; Height: 1.00MM; Weight: NA; Temperature: -40°C+125°C; Datasheet: Y:\MIS_DATABASE\DATASHEETS\ICS\POWER\TPS6282XX-DEC2020.PDF; Crtd /date: MANIRAJA/071021; Chkd/date: ALVY/071021; MECHANICAL 3D STEP FILE: VSONHR6_TPS62826_60X60_1; Library Path: Y:\MIS_DATABASE\Library\ALTIUM_TOOL\SCHEMATICS_PARTS\MS_MISCPOWER_Library.schlib; Footprint Path: Y:\MIS_DATABASE\Library\ALTIUM_TOOL\PCB_FOOTPRINTS\Altium_Footprint_Lib.PcbLib
U67 = LM61460_VQFNHR14: IC 6A ADJ AUTO LOW EMI SYNCHRONOUS STEP DOWN DC-DC CONVERTER VQFN-HR14; Mistral Part No: 142021020006-R; Mfr_name: TEXAS INSTRUMENTS; Part_type: ICS\POWER\DC-DC CONVERTER; Project: J7ES_SK_BRD; Tolerance: NA; Customs_HS_Code: 85423100; Custom_Duty: 15%; Footprint Ref: VQFNHR14_LM61460_160X140_1; Mfr_part_number: LM61460AANQRJRRQ1; Voltage: NA; Wattage: NA; Package: VQFN-HR14; Distributor_name: DIGIKEY; Distributor_part_number: 296-LM61460AANQRJRRQ1TR-ND; Library Ref: LM61460_VQFNHR14; Height: 1.00MM; Weight: NA; Temperature: -40°C+150°C; Datasheet: Y:\MIS_DATABASE\DATASHEETS\ICS\POWER\LM61460-Q1.PDF; Crtd /date: MANIRAJA/030221; Chkd/date: ALVY/040221; MECHANICAL 3D STEP FILE: VQFNHR14_LM61460_160X140_1; Library Path: Y:\MIS_DATABASE\Library\ALTIUM_TOOL\SCHEMATICS_PARTS\MS_MISCPOWER_Library.schlib; Footprint Path: Y:\MIS_DATABASE\Library\ALTIUM_TOOL\PCB_FOOTPRINTS\Altium_Footprint_Lib.PcbLib; PCB Footprint: VQFNHR14_LM61460_160X140_1